# EAGLE design dl-12 (EAGLE 4.11)
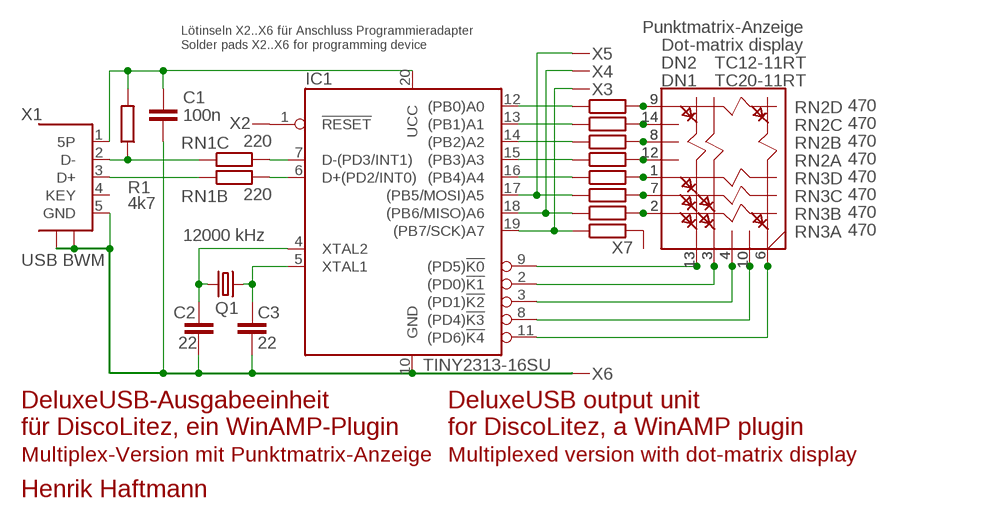
[diagram p0: schematic, sheet 1]

## Parts
C1  100n  C  [0603]
C2  22  C  [0603]
C3  22  C  [0603]
DN1  TC20-11RT  DOTMATRIX5X7CCL  [TA20-11]
DN2  TC12-11RT  DOTMATRIX5X7CCM  [TA12-11]
IC1  TINY2313-16SU  [SO20L]
Q1  12000 kHz  CRYSTALHC49S  [HC49/S]
R1  4k7  R  [0603]
RN1  220  RN-4P1206  [R-4P]
RN2  470  RN-4P1206  [R-4P]
RN3  470  RN-4P1206  [R-4P]
X1  USB BWM  USB-MINIB  [USB-DB]
X2  PADL  [SMD-2MM]
X3  PADL  [SMD-2MM]
X4  PADL  [SMD-2MM]
X5  PADL  [SMD-2MM]
X6  PADL  [SMD-2MM]
X7  PADL  [SMD-2MM]

## Nets
5P: C1.1 IC1.20(UCC) R1.2 X1.1(5P)
D+: RN1.2 X1.3(D+)
D-: R1.1 RN1.3 X1.2(D-)
GND: C1.2 C2.2 C3.2 IC1.10(GND) X1.5(GND) X1.G1(GND) X1.G2(GND) X6.1
K0: DN1.6(C5) DN2.6(C5) IC1.11((PD6)!K4)
K1: DN1.10(C4) DN2.10(C4) IC1.8((PD4)!K3)
K2: DN1.4(C3) DN2.4(C3) IC1.3((PD1)!K2)
K3: DN1.3(C2) DN2.3(C2) IC1.2((PD0)!K1)
K4: DN1.13(C1) DN2.13(C1) IC1.9((PD5)!K0)
N$1: DN1.2(R7) DN2.2(R7) RN3.7
N$2: DN1.7(R6) DN2.7(R6) RN3.6
N$3: DN1.1(R5) DN2.1(R5) RN3.5
N$4: DN1.12(R4) DN2.12(R4) RN2.8
N$5: DN1.8(R3) DN2.8(R3) RN2.7
N$6: DN1.14(R2) DN2.14(R2) RN2.6
N$7: DN1.9(R1) DN2.9(R1) RN2.5
N$8: IC1.17((PB5/MOSI)A5) RN3.3 X5.1
N$9: IC1.18((PB6/MISO)A6) RN3.2 X4.1
N$10: IC1.12((PB0)A0) RN2.4
N$11: IC1.13((PB1)A1) RN2.3
N$12: IC1.14((PB2)A2) RN2.2
N$13: IC1.15((PB3)A3) RN2.1
N$14: IC1.16((PB4)A4) RN3.4
N$15: IC1.19((PB7/SCK)A7) RN3.1 X3.1
N$16: IC1.6(D+(PD2/INT0)) RN1.7
N$17: IC1.7(D-(PD3/INT1)) RN1.6
N$22: RN3.8 X7.1
RESET: IC1.1(!RESET) X2.1
XTAL1: C3.1 IC1.5(XTAL1) Q1.2
XTAL2: C2.1 IC1.4(XTAL2) Q1.1
Unconnected: RN1.1 RN1.4 RN1.5 RN1.8 X1.4(KEY)

## Notes on the sheet
- Lötinseln X2..X6 für Anschluss Programmieradapter | Punktmatrix-Anzeige
- Solder pads X2..X6 for programming device | Dot-matrix display
- DeluxeUSB-Ausgabeeinheit | DeluxeUSB output unit
- für DiscoLitez, ein WinAMP-Plugin | for DiscoLitez, a WinAMP plugin
- Multiplex-Version mit Punktmatrix-Anzeige | Multiplexed version with dot-matrix display
- Henrik Haftmann

## Library data of the parts
C1-C3 = dl:C: Kondensator
DN1 DN2 = dl:DOTMATRIX5X7CC: LED-Punktmatrix-Anzeige 5x7 Spalten = Katoden
IC1 = dl:TINY2313*: 8-bit AVR-Microkontroller with 2 kBytes Flash Darstellung für DLO_DeluxeUsbMux
Q1 = dl:CRYSTAL: Quarz 2 Anschlüsse
R1 = dl:R: Widerstand
RN1-RN3 = dl:RN-4P: Widerstandsnetzwerk 4 Parallel
X1 = dl:USB-MINIB: USB-MiniB-Buchse
X2-X7 = dl:PAD: Einfaches Lötpad

## Board
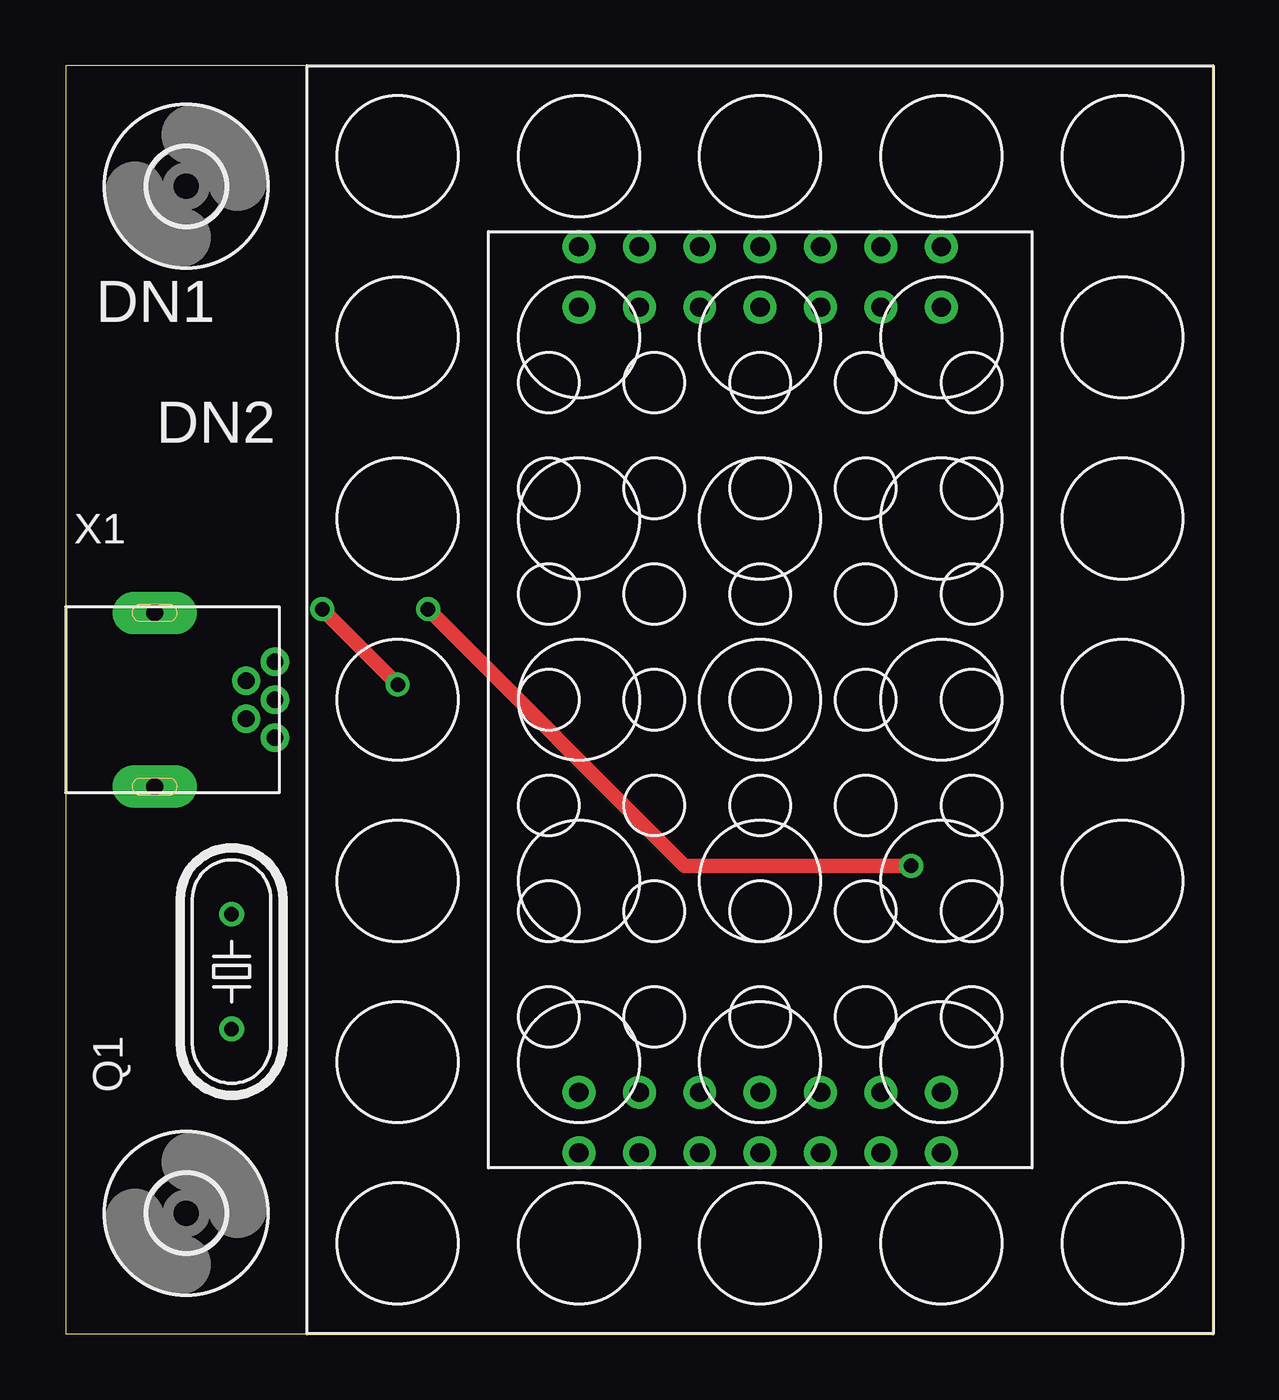
[diagram p1: board, top side]
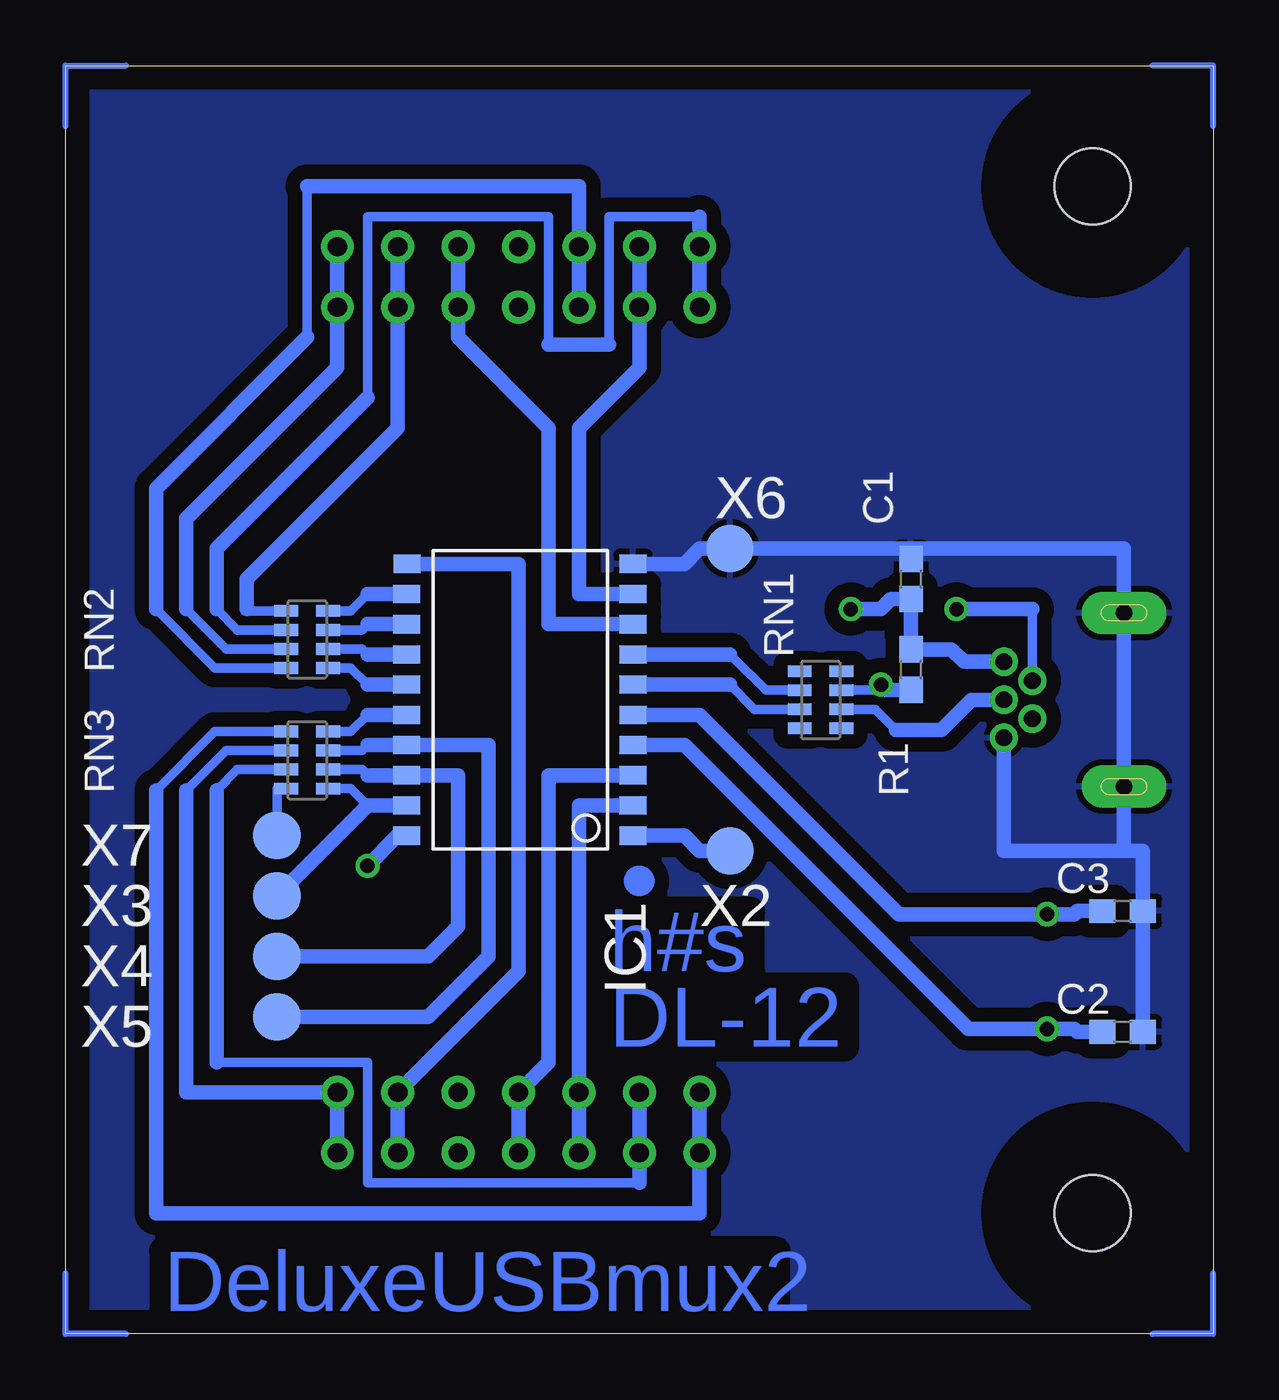
[diagram p2: board, bottom side, seen from below]

Size 48.26 x 53.34 mm. Coordinates in mm from the lower left corner, seen from the top.
Outline: 0,0 48.26,0 48.26,53.34 0,53.34 0,0
Copper layers (1*16): Top 0.035mm / dielectric 1.5mm / Bottom 0.035mm
Design rules "default": minimum track width 0.25mm, minimum drill 0.5mm, track to track 0.25mm, track to pad 0.25mm, pad to pad 0.25mm, via to via 0.25mm, smd to smd 0mil, copper to edge 1mm, drill to drill 0.5mm, minimum pad ring 0.2mm, minimum via ring 0.2mm, stop-mask expansion 4mil, vias tented up to drill 0mil, thermal gap 10mil

### Footprints (pad centres in the part's own frame; a part is rotated, then mirrored left to right if it is on the bottom)
0603 = smd 1.1 x 1: 1 -0.85,0; 2 0.85,0
TA20-11 = drill 0.813 round: 1 -7.62,-19.05; 2 -5.08,-19.05; 3 -2.54,-19.05; 4 0,-19.05; 5 2.54,-19.05; 6 5.08,-19.05; 7 7.62,-19.05; 8 7.62,19.05; 9 5.08,19.05; 10 2.54,19.05; 11 0,19.05; 12 -2.54,19.05; 13 -5.08,19.05; 14 -7.62,19.05
TA12-11 = drill 0.813 round: 1 -7.62,-16.51; 2 -5.08,-16.51; 3 -2.54,-16.51; 4 0,-16.51; 5 2.54,-16.51; 6 5.08,-16.51; 7 7.62,-16.51; 8 7.62,16.51; 9 5.08,16.51; 10 2.54,16.51; 11 0,16.51; 12 -2.54,16.51; 13 -5.08,16.51; 14 -7.62,16.51
SO20L = smd 0.762 x 1.143: 1 -5.715,-4.813; 2 -4.445,-4.813; 3 -3.175,-4.813; 4 -1.905,-4.813; 5 -0.635,-4.813; 6 0.635,-4.813; 7 1.905,-4.813; 8 3.175,-4.813; 9 4.445,-4.813; 10 5.715,-4.813; 11 5.715,4.686; 12 4.445,4.712; 13 3.175,4.712; 14 1.905,4.712; 15 0.635,4.712; 16 -0.635,4.712; 17 -1.905,4.712; 18 -3.175,4.712; 19 -4.445,4.712; 20 -5.715,4.712
HC49/S = drill 0.61 round: 1 -2.413,0; 2 2.413,0
R-4P = smd 0.5 x 1: 1 -1.2,-0.88; 2 -0.4,-0.88; 3 0.4,-0.88; 4 1.2,-0.88; 5 1.2,0.88; 6 0.4,0.88; 7 -0.4,0.88; 8 -1.2,0.88
3,2 = hole 3.2: 0,0
USB-DB = drill 0.7 round: 1 8.8,1.6; 2 7.6,0.8; 3 8.8,0; 4 7.6,-0.8; 5 8.8,-1.6 | drill 0.7 pad 1.778 long: G1 3.75,3.65; G2 3.75,-3.65
SMD-2MM = smd 2 x 2: 1 0,0

### Placement (x,y rotation side)
C1  12.7,31.75 90 bottom
C2  3.81,12.7 0 bottom
C3  3.81,17.78 0 bottom
DN1  29.21,26.67 0 top
DN2  29.21,26.67 0 top
IC1  29.21,26.67 90 bottom
Q1  6.99,15.24 90 top
R1  12.7,27.94 90 bottom
RN1  16.51,26.67 90 bottom
RN2  38.1,29.21 90 bottom
RN3  38.1,24.13 90 bottom
U$1  [3,2]  5.08,5.08 0 top
U$2  [3,2]  5.08,48.26 0 top
X1  0,26.67 0 top
X2  20.32,20.32 0 bottom
X3  39.37,18.41 0 bottom
X4  39.37,15.88 0 bottom
X5  39.37,13.34 0 bottom
X6  20.32,33.02 0 bottom
X7  39.37,20.95 0 bottom

### Tracks (layer width: path | path; a pad name or v marks a point on that pad's centre or on a via)
5P  (via drill 0.61)
  Top 0.61: v35.56,19.68 26.04,19.68 v15.24,30.48
  Bottom 0.61: IC1.20 34.29,20.95 v35.56,19.68 | v15.24,30.48 13.97,30.48 13.55,30.9 C1.1 R1.2 11.01,28.79 10.49,28.27 X1.1
D+
  Bottom 0.406: RN1.2 14.21,26.27 13.34,25.4
  Bottom 0.61: X1.3 10.16,26.67 11.43,25.4 13.34,25.4
D-  (via drill 0.61)
  Top 0.61: v10.79,30.48 v13.97,27.3
  Bottom 0.406: X1.2 7.6,30.48 | RN1.3 14.21,27.07 v13.97,27.3
  Bottom 0.61: 7.6,30.48 v10.79,30.48 | R1.1 13.76,27.09 v13.97,27.3
GND
  Bottom 0.61: 12.7,33.02 C1.2 | 12.7,33.02 X6.1 21.59,33.02 22.23,32.38 IC1.10 | 3.75,20.32 X1.G2 X1.G1 3.75,33.02 12.7,33.02 | 3.75,20.32 2.96,20.32 C3.2 C2.2 | X1.5 8.8,20.32 3.75,20.32
  pour Bottom (isolate 0.61): 0,53.34 48.26,53.34 48.26,0 0,0
K0
  Bottom 0.61: IC1.11 29.21,32.38 29.21,15.24 DN2.6 DN1.6
K1
  Bottom 0.61: IC1.8 27.94,29.84 27.94,38.1 31.75,41.91 DN2.10 DN1.10
K2
  Bottom 0.61: IC1.3 27.94,23.5 27.94,11.43 DN2.4 DN1.4
K3
  Bottom 0.61: IC1.2 26.67,22.23 DN2.3 DN1.3
K4
  Bottom 0.61: IC1.9 26.67,31.11 26.67,38.1 24.13,40.64 DN2.13 DN1.13
N$1
  Bottom 0.406: 41.91,11.43 35.56,11.43 35.56,6.35 24.13,6.35 | RN3.7 41.04,23.73 41.91,22.86
  Bottom 0.61: 41.91,11.43 41.91,22.86 | 24.13,6.35 DN1.2 DN2.2
N$2
  Bottom 0.406: RN3.6 41.51,24.53 43.18,22.86
  Bottom 0.61: 43.18,22.86 43.18,10.16 DN2.7 DN1.7
N$3
  Bottom 0.406: RN3.5 41.98,25.33 44.45,22.86
  Bottom 0.61: 44.45,22.86 44.45,5.08 21.59,5.08 DN1.1 DN2.1
N$4
  Bottom 0.406: 38.1,41.91 38.1,48.26 | RN2.8 41.98,28.01 44.45,30.48
  Bottom 0.61: 44.45,30.48 44.45,35.56 38.1,41.91 | 38.1,48.26 26.67,48.26 DN1.12 DN2.12
N$5
  Bottom 0.406: RN2.7 41.51,28.81 43.18,30.48
  Bottom 0.61: 43.18,30.48 43.18,34.29 36.83,40.64 DN2.8 DN1.8
N$6
  Bottom 0.406: 35.56,39.37 35.56,46.99 27.94,46.99 27.94,41.59 | 21.59,46.99 25.4,46.99 25.4,41.59 | RN2.6 41.04,29.61 41.91,30.48
  Bottom 0.61: 35.56,39.37 41.91,33.02 41.91,30.48 | 25.4,41.59 27.94,41.59 | 21.59,46.99 DN1.14 DN2.14
N$7
  Bottom 0.406: RN2.5 40.57,30.41 40.64,30.48
  Bottom 0.61: 40.64,30.48 40.64,31.75 34.29,38.1 DN1.9 DN2.9
N$8
  Bottom 0.406: RN3.3 35.8,24.53 35.56,24.77
  Bottom 0.61: 35.56,24.77 IC1.17 30.48,24.77 30.48,15.88 33.02,13.34 X5.1
N$9
  Bottom 0.406: RN3.2 35.8,23.73 35.56,23.5
  Bottom 0.61: 35.56,23.5 IC1.18 31.75,23.5 31.75,17.14 33.02,15.88 X4.1
N$10
  Bottom 0.406: RN2.4 36.27,30.41 35.56,31.11
  Bottom 0.61: IC1.12 35.56,31.11
N$11
  Bottom 0.406: RN2.3 35.8,29.61 35.56,29.84
  Bottom 0.61: IC1.13 35.56,29.84
N$12
  Bottom 0.406: RN2.2 35.8,28.81 35.56,28.57
  Bottom 0.61: IC1.14 35.56,28.57
N$13
  Bottom 0.406: RN2.1 36.27,28.01 35.56,27.3
  Bottom 0.61: IC1.15 35.56,27.3
N$14
  Bottom 0.406: RN3.4 36.27,25.33 35.56,26.04
  Bottom 0.61: IC1.16 35.56,26.04
N$15
  Bottom 0.406: RN3.1 36.27,22.93 35.56,22.23
  Bottom 0.61: IC1.19 35.56,22.23 X3.1
N$16
  Bottom 0.406: RN1.7 19.29,26.27 20.32,27.3
  Bottom 0.61: 20.32,27.3 IC1.6
N$17
  Bottom 0.406: RN1.6 18.82,27.07 20.32,28.57
  Bottom 0.61: 20.32,28.57 IC1.7
N$18
  Bottom 0.254: 0,50.8 0,53.34 2.54,53.34
N$19
  Bottom 0.254: 45.72,53.34 48.26,53.34 48.26,50.8
N$20
  Bottom 0.254: 48.26,2.54 48.26,0 45.72,0
N$21
  Bottom 0.254: 2.54,0 0,0 0,2.54
N$22
  Bottom 0.406: RN3.8 39.37,22.93 X7.1
RESET
  Bottom 0.61: IC1.1 22.23,20.95 21.59,20.32 X2.1
XTAL1
  Bottom 0.61: IC1.5 21.59,26.04 13.21,17.65 Q1.2 5.84,17.65 5.71,17.78 C3.1
XTAL2
  Bottom 0.61: IC1.4 22.23,24.77 10.29,12.83 Q1.1 5.84,12.83 5.71,12.7 C2.1
(copper drawn outside any net)
  shapes: Bottom circle x1

### Text on the board
Bottom: h#s | DL-12 | DeluxeUSBmux2
Measures: 48 | 53